# EAGLE design schematic (EAGLE 9.6.2)
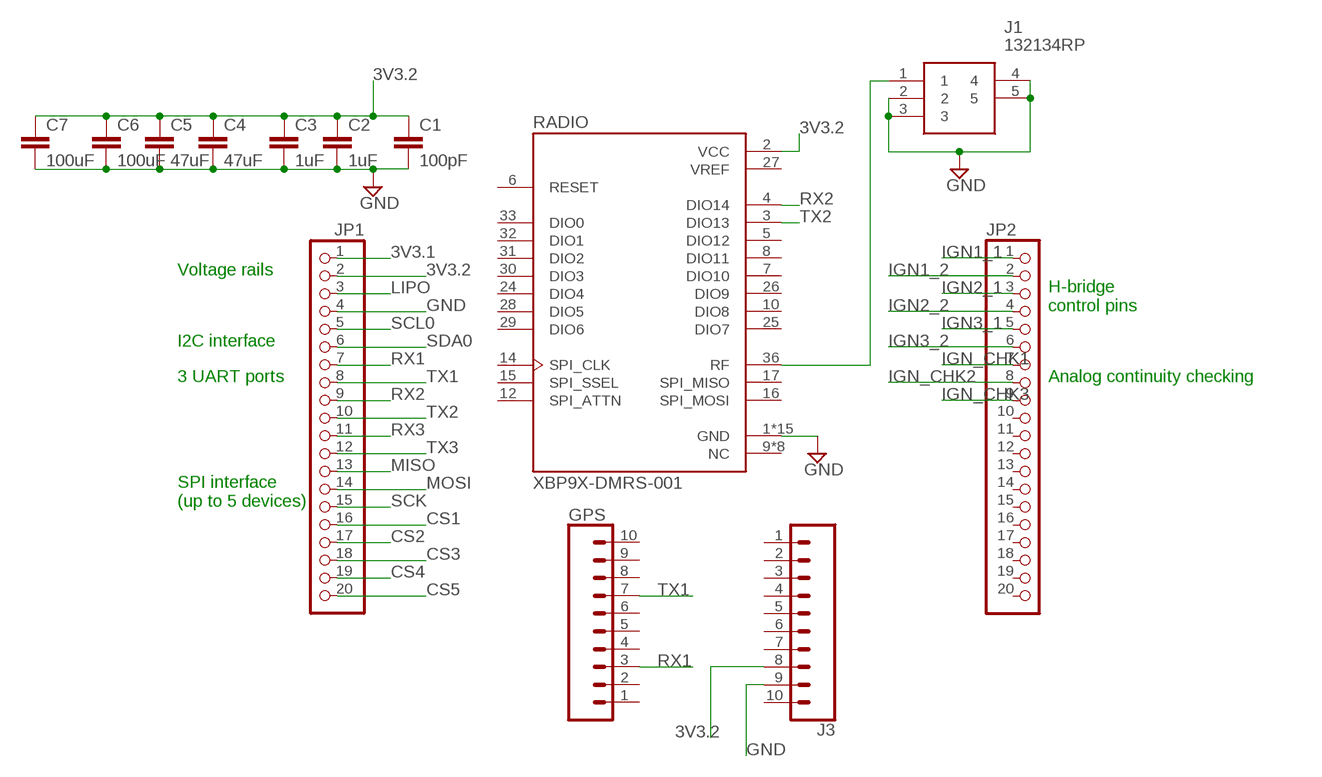
[diagram p0: schematic, sheet 1]

## Parts
C1  100pF  0.1UF-0603-100V-10%  [0603]
C2  1uF  2.2UF-CERCAP-10009  [1206]
C3  1uF  2.2UF-CERCAP-10009  [1206]
C4  47uF  2.2UF-CERCAP-10009  [1206]
C5  47uF  2.2UF-CERCAP-10009  [1206]
C6  100uF  2.2UF-CERCAP-10009  [1206]
C7  100uF  2.2UF-CERCAP-10009  [1206]
GPS  CONN_10NO_SILK_PTH_FEMALE  [1X10_NO_SILK]
J1  132134RP  [132134RP]
J3  CONN_10NO_SILK_PTH_FEMALE  [1X10_NO_SILK]
JP1  PINHD-1X20  [1X20]
JP2  PINHD-1X20  [1X20]
RADIO  XBP9X-DMRS-001  [MODULE_XBP9X-DMRS-001]

## Nets
3V3.1: JP1.1
3V3.2: C1.1 C2.1 C3.1 C4.1 C5.1 C6.1 C7.1 J3.8 JP1.2 RADIO.2(VCC)
CS1: JP1.16
CS2: JP1.17
CS3: JP1.18
CS4: JP1.19
CS5: JP1.20
GND: C1.2 C2.2 C3.2 C4.2 C5.2 C6.2 C7.2 J1.2 J1.3 J1.4 J1.5 J3.9 JP1.4 RADIO.1(GND) RADIO.11(GND) RADIO.13(GND) RADIO.22(GND) RADIO.35(GND) RADIO.38(GND) RADIO.V38_1(GND) RADIO.V38_2(GND) RADIO.V38_3(GND) RADIO.V38_4(GND) RADIO.V38_5(GND) RADIO.V38_6(GND) RADIO.V38_7(GND) RADIO.V38_8(GND) RADIO.V38_9(GND)
IGN1_1: JP2.1
IGN1_2: JP2.2
IGN2_1: JP2.3
IGN2_2: JP2.4
IGN3_1: JP2.5
IGN3_2: JP2.6
IGN_CHK1: JP2.7
IGN_CHK2: JP2.8
IGN_CHK3: JP2.9
LIPO: JP1.3
MISO: JP1.13
MOSI: JP1.14
RF: J1.1 RADIO.36(RF)
RX1: GPS.3 JP1.7
RX2: JP1.9 RADIO.4(DIO14)
RX3: JP1.11
SCK: JP1.15
SCL0: JP1.5
SDA0: JP1.6
TX1: GPS.7 JP1.8
TX2: JP1.10 RADIO.3(DIO13)
TX3: JP1.12
Unconnected: GPS.1 GPS.2 GPS.4 GPS.5 GPS.6 GPS.8 GPS.9 GPS.10 J3.1 J3.2 J3.3 J3.4 J3.5 J3.6 J3.7 J3.10 JP2.10 JP2.11 JP2.12 JP2.13 JP2.14 JP2.15 JP2.16 JP2.17 JP2.18 JP2.19 JP2.20 RADIO.5(DIO12) RADIO.6(RESET) RADIO.7(DIO10) RADIO.8(DIO11) RADIO.9(NC) RADIO.10(DIO8) RADIO.12(SPI_ATTN) RADIO.14(SPI_CLK) RADIO.15(SPI_SSEL) RADIO.16(SPI_MOSI) RADIO.17(SPI_MISO) RADIO.18(NC) RADIO.19(NC) RADIO.20(NC) RADIO.21(NC) RADIO.23(NC) RADIO.24(DIO4) RADIO.25(DIO7) RADIO.26(DIO9) RADIO.28(DIO5) RADIO.29(DIO6) RADIO.30(DIO3) RADIO.31(DIO2) RADIO.32(DIO1) RADIO.33(DIO0) RADIO.34(NC) RADIO.37(NC)

## Notes on the sheet
- Voltage rails
- H-bridge
  control pins
- I2C interface
- 3 UART ports | Analog continuity checking
- SPI interface
  (up to 5 devices)

## Power pins joined to a net without a drawn wire
VREF: RADIO.27(VREF)

## Library data of the parts
C1 = SparkFun-Capacitors:0.1UF: 0.1µF ceramic capacitors A capacitor is a passive two-terminal electrical component used to store electrical energy temporarily in an electric field.; PROD_ID: CAP-08390; VALUE: 0.1uF
C2-C7 = SparkFun-Retired:2.2UF-CER: 2.2uF Ceramic SMT CAP-07888- 10V, 20% (0603) CAP-10009- 50V, 10% (1206); PROD_ID: CAP-10009; VALUE: 2.2uF
GPS J3 = SparkFun-Connectors:CONN_10: Multi connection point. Often used as Generic Header-pin footprint for 0.1 inch spaced/style header connections On any of the 0.1 inch spaced packages, you can populate with these: Break Away Headers - Straight <https://www.sparkfun.com/products/116> (PRT-00116) Break Away Male Headers - Right Angle <https://www.sparkfun.com/products/553> (PRT-00553) Female Headers <https://www.sparkfun.com/products/115> (PRT-00115) Break Away Headers - Machine Pin <https://www.sparkfun.com/products/117> (PRT-00117) Break Away Female Headers - Swiss Machine Pin <https://www.sparkfun.com/products/743> (PRT-00743) Arduino Stackable Header - 10 Pin <https://www.sparkfun.com/products/11376> (PRT-11376) For SCREWTERMINALS and SPRING TERMINALS visit here: Screw Terimnals on SparkFun.com <https://www.sparkfun.com/search/results?term=Screw+Terminals> (5mm/3.5mm/2.54mm spacing) This device is also useful as a general connection point to wire up your design to another part of your project. Our various solder wires solder well into these plated through hole pads. Hook-Up Wire - Assortment (Stranded, 22 AWG) <https://www.sparkfun.com/products/11375> (PRT-11375) Hook-Up Wire - Assortment (Solid Core, 22 AWG) <https://www.sparkfun.com/products/11367> (PRT-11367) View the entire wire category on our website here <https://www.sparkfun.com/categories/141> Special notes: Molex polarized connector foot print use with SKU : PRT-08231 with associated crimp pins and housings. 1MM SMD Version SKU: PRT-10208 NOTES ON THE VARIANTS LOCK and LOCK_LONGPADS... This footprint was designed to help hold the alignment of a through-hole component (i.e. 6-pin header) while soldering it into place. You may notice that each hole has been shifted either up or down by 0.005 of an inch from it's more standard position (which is a perfectly straight line). This slight alteration caused the pins (the squares in the middle) to touch the edges of the holes. Because they are alternating, it causes a "brace" to hold the component in place. 0.005 has proven to be the perfect amount of "off-center" position when using our standard breakaway headers. Although looks a little odd when you look at the bare footprint, once you have a header in there, the alteration is very hard to notice. Also,if you push a header all the way into place, it is covered up entirely on the bottom side.
J1 = 132134RP:132134RP: SMA REVERSE POLARITY P.C.B. JACK Source: Datasheet <https://datasheet.datasheetarchive.com/originals/distributors/Datasheets-DGA15/760404.pdf>; DESCRIPTION: SMA REVERSE POLARITY P.C.B. JACK; HEIGHT: 9.53mm; MANUFACTURER_NAME: Amphenol; MANUFACTURER_PART_NUMBER: 132134RP; MOUSER_PART_NUMBER: 523-132134RP; MOUSER_PRICE-STOCK: https://www.mouser.co.uk/ProductDetail/Amphenol-RF/132134RP?qs=Ld4zsxSTIA6y6Ienrae61w%3D%3D
JP1 JP2 = adafruit:PINHD-1X20: PIN HEADER
RADIO = XBP9X-DMRS-001:XBP9X-DMRS-001: General ISM < 1GHz Transceiver Module 902MHz ~ 928MHz Antenna Not Included, RF Pad Surface Mount Check availability <https://pricing.snapeda.com/parts/XBP9X-DMRS-001/Digi%20International/view-part?ref=eda>; AVAILABILITY: In Stock; DESCRIPTION: General ISM < 1GHz - Transceiver Module 902MHz ~ 928MHz Antenna Not Included, RF Pad Surface Mount; MF: Digi International; MP: XBP9X-DMRS-001; PACKAGE: Module Digi International; PRICE: None; PURCHASE-URL: https://pricing.snapeda.com/search/part/XBP9X-DMRS-001/?ref=eda

## Board
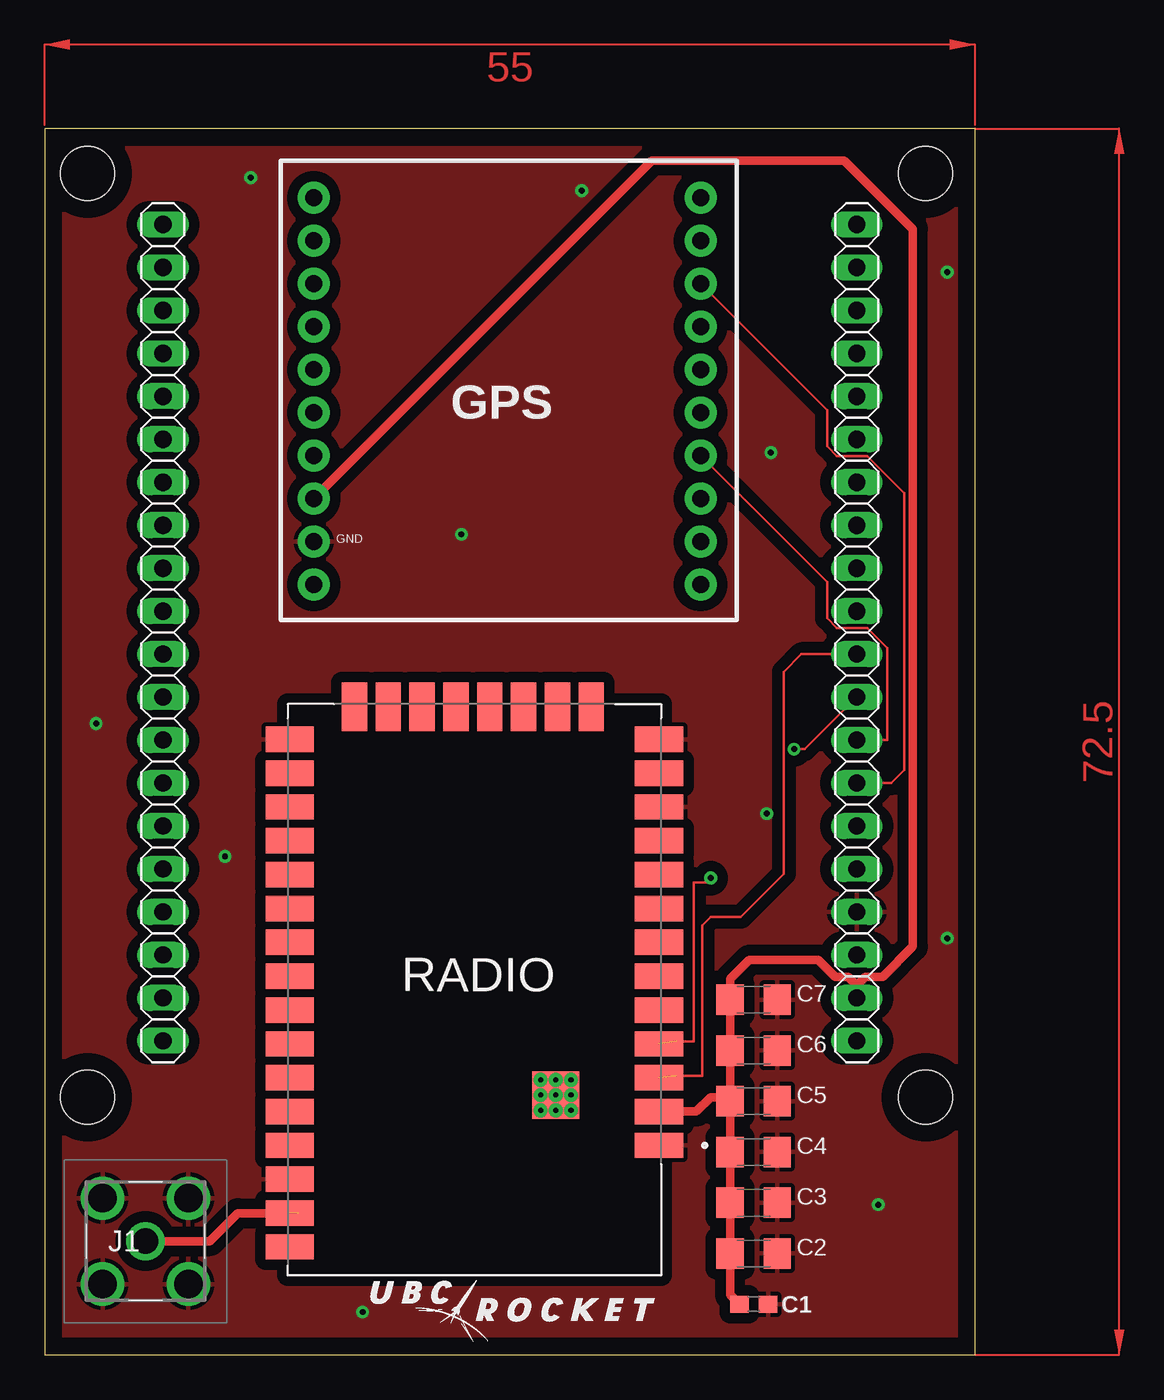
[diagram p1: board, top side]
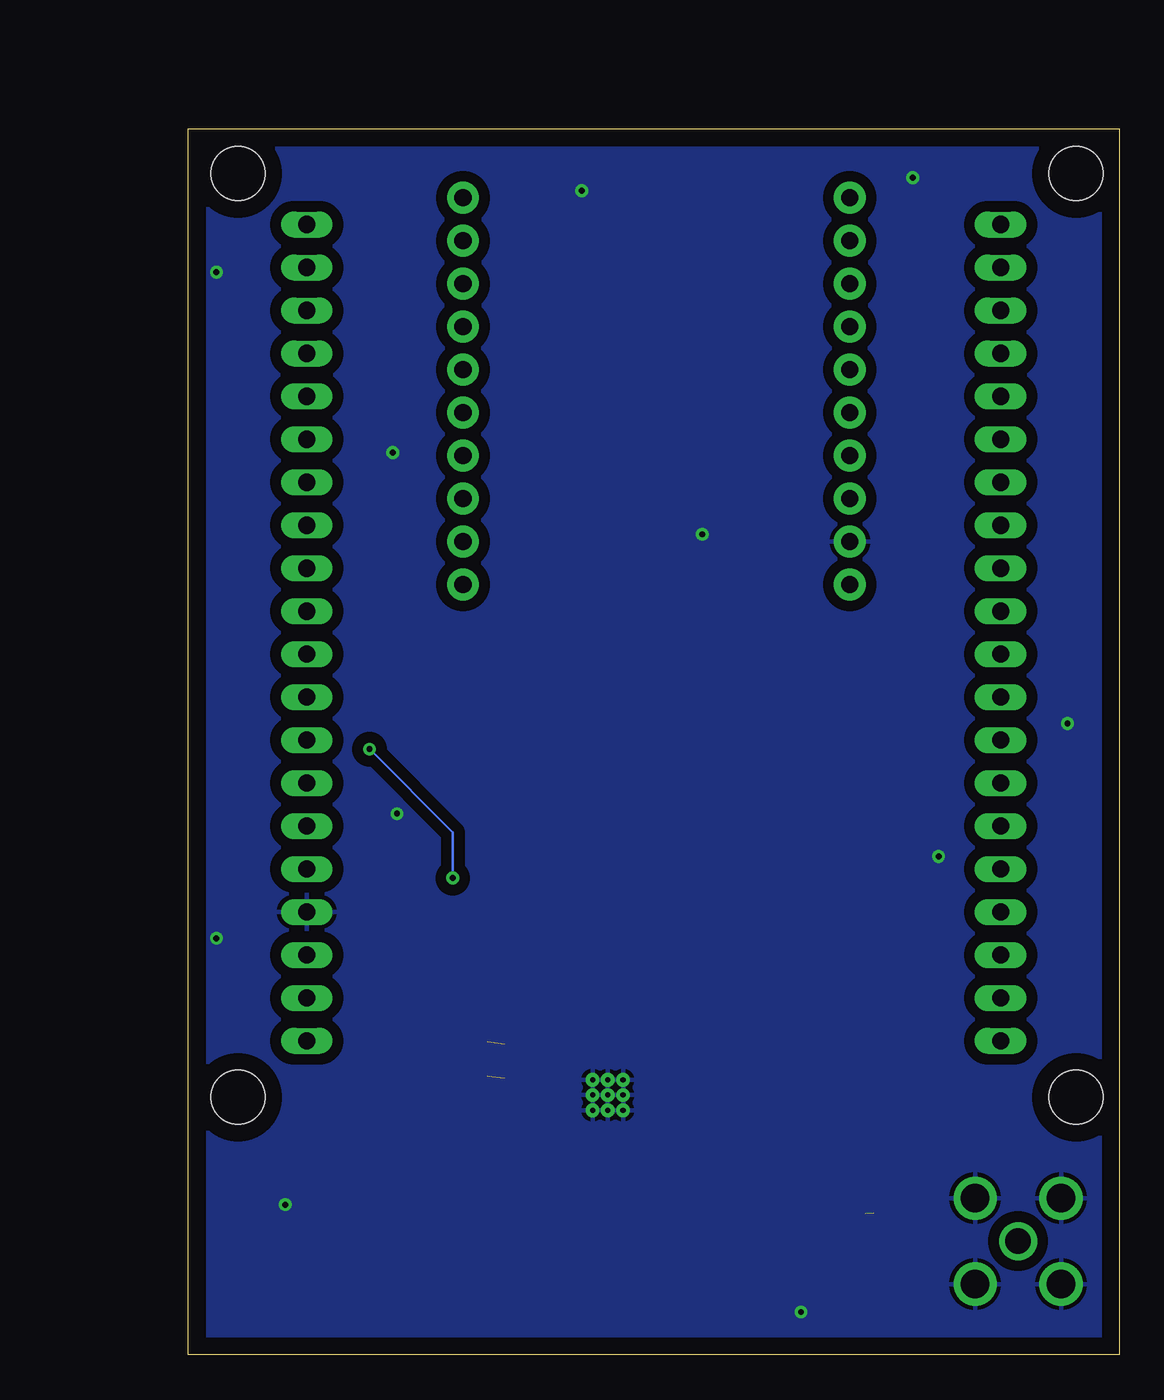
[diagram p2: board, bottom side, seen from below]

Size 55 x 72.5 mm. Coordinates in mm from the lower left corner, seen from the top.
Outline: 0,0 55,0 55,72.5 0,72.5 0,0
Copper layers (1*16): Top 0.035mm / dielectric 1.5mm / Bottom 0.035mm
Design rules "default": minimum track width 6mil, minimum drill 0.35mm, track to track 6mil, track to pad 6mil, pad to pad 6mil, via to via 6mil, smd to smd 6mil, copper to edge 40mil, drill to drill 6mil, minimum pad ring 10mil, minimum via ring 8mil, stop-mask expansion 4mil, vias tented up to drill 0mil, thermal gap 10mil
Holes 3.17 mm at 2.54,15.24 52.07,15.24 52.07,69.85 2.54,69.85

### Footprints (pad centres in the part's own frame; a part is rotated, then mirrored left to right if it is on the bottom)
0603 = smd 1.1 x 1: 1 -0.85,0; 2 0.85,0
1206 = smd 1.6 x 1.8: 1 -1.4,0; 2 1.4,0
1X10_NO_SILK = drill 1.016 pad 1.88: 1 0,0; 2 2.54,0; 3 5.08,0; 4 7.62,0; 5 10.16,0; 6 12.7,0; 7 15.24,0; 8 17.78,0; 9 20.32,0; 10 22.86,0
132134RP = drill 1.5 pad 2.25: 1 0,0 | drill 1.7 pad 2.55: 2 -2.54,2.54; 3 -2.54,-2.54; 4 2.54,-2.54; 5 2.54,2.54
1X20 = drill 1.016 long: 1 -24.13,0; 2 -21.59,0; 3 -19.05,0; 4 -16.51,0; 5 -13.97,0; 6 -11.43,0; 7 -8.89,0; 8 -6.35,0; 9 -3.81,0; 10 -1.27,0; 11 1.27,0; 12 3.81,0; 13 6.35,0; 14 8.89,0; 15 11.43,0; 16 13.97,0; 17 16.51,0; 18 19.05,0; 19 21.59,0; 20 24.13,0
MODULE_XBP9X-DMRS-001 = smd 2.86 x 1.5: 1 -10.91,9.195; 2 -10.91,7.195; 3 -10.91,5.195; 4 -10.91,3.195; 5 -10.91,1.195; 6 -10.91,-0.805; 7 -10.91,-2.805; 8 -10.91,-4.805; 9 -10.91,-6.805; 10 -10.91,-8.805; 11 -10.91,-10.805; 12 -10.91,-12.805; 13 -10.91,-14.805; 22 10.91,-14.805; 23 10.91,-12.805; 24 10.91,-10.805; 25 10.91,-8.805; 26 10.91,-6.805; 27 10.91,-4.805; 28 10.91,-2.805; 29 10.91,-0.805; 30 10.91,1.195; 31 10.91,3.195; 32 10.91,5.195; 33 10.91,7.195; 34 10.91,9.195; 35 10.91,11.195; 36 10.91,13.195; 37 10.91,15.195 | smd 1.5 x 2.86: 14 -6.912,-16.725; 15 -4.912,-16.725; 16 -2.912,-16.725; 17 -0.912,-16.725; 18 1.088,-16.725; 19 3.088,-16.725; 20 5.088,-16.725; 21 7.088,-16.725 | smd 2.794 x 2.794: 38 -4.814,6.223 | drill 0.3 pad 0.508: V38_1 -5.714,7.123; V38_2 -4.814,7.123; V38_3 -3.914,7.123; V38_4 -5.714,6.223; V38_5 -4.814,6.223; V38_6 -3.914,6.223; V38_7 -5.714,5.323; V38_8 -4.814,5.323; V38_9 -3.914,5.323

### Placement (x,y rotation side)
C1  41.91,3 0 top
C2  41.91,6 0 top
C3  41.91,9 0 top
C4  41.91,12 0 top
C5  41.91,15 0 top
C6  41.91,18 0 top
C7  41.91,21 0 top
GPS  38.77,68.41 270 top
J1  5.97,6.73 0 top
J3  15.91,68.41 270 top
JP1  48,42.7 90 top
JP2  7,42.7 90 top
RADIO  25.4,21.59 180 top

### Tracks (layer width: path | path; a pad name or v marks a point on that pad's centre or on a via)
3V3.2
  Top 0.152: 40.51,3.55 C2.1 40.51,6.35 40.51,8.89 C3.1 C4.1 40.51,12.7 C5.1 | C6.1 C7.1
  Top 0.508: RADIO.2 38.52,14.39 39.37,15.24 40.27,15.24 C5.1 | C1.1 40.51,3.55 40.51,6.35 | C2.1 40.51,8.89 | C3.1 40.51,12.7 | C4.1 C5.1 | C5.1 C6.1 40.51,22.22 41.66,23.37 45.72,23.37 46.74,22.35 47.5,22.35 48.01,21.84 JP1.2 48,21.84 48.51,22.35 49.53,22.35 51.32,24.14 51.32,66.56 47.27,70.61 35.9,70.61 J3.8
GND  (via drill 0.35)
  other vias: 3.05,37.34 31.75,68.83 10.67,29.46 12.19,69.6 24.64,48.51 42.93,53.34 53.34,64.01 42.67,32 53.34,24.64 49.28,8.89 18.8,2.54
  pour Top (isolate 0.635): 0.51,72.14 0.51,0.51 54.36,0.51 54.36,72.14
  pour Bottom (isolate 0.635): 0.76,71.88 0.76,0.76 53.85,0.76 53.85,71.88
RF  (1 unrouted)
  Top 0.508: J1.1 9.78,6.73 11.43,8.38 14.99,8.38
RX1
  Top 0.152: JP1.7 50.03,33.81 50.8,34.58 50.8,50.95 48.61,53.14 46.83,53.14 46.25,53.72 46.25,55.85 GPS.3
RX2  (via drill 0.35)  (1 unrouted)
  Top 0.152: JP1.9 44.92,35.81 v44.3,35.81 | v39.37,28.19 39.12,27.94 38.35,27.94 38.35,18.54 37.34,18.54
  Bottom 0.152: v44.3,35.81 39.37,30.89 v39.37,28.19
TX1
  Top 0.152: JP1.8 49.81,36.35 49.81,41.78 48.61,42.98 46.83,42.98 46.25,43.56 46.25,45.69 GPS.7
TX2  (1 unrouted)
  Top 0.152: JP1.10 44.73,41.43 43.69,40.39 43.69,28.45 41.15,25.91 39.37,25.91 38.86,25.4 38.86,16.51 37.34,16.51
(copper drawn outside any net)
  shapes: Top area x2

### Text on the board
tPlace: GND